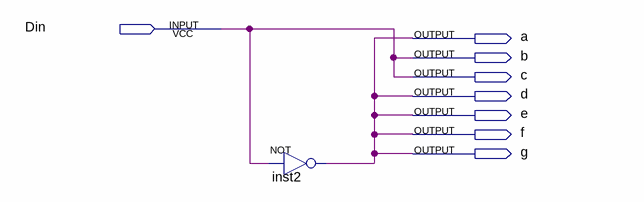
[diagram p0: schematic sheet]
// Quartus schematic render_tapeSymbol_1.bdf as structural Verilog: 1 symbols, 8 pins
module render_tapeSymbol_1 (
  input  Din,
  output a,
  output b,
  output c,
  output d,
  output e,
  output f,
  output g
);

  not inst2 (a, Din);

  assign b = Din;
  assign c = Din;
  assign d = a;
  assign e = a;
  assign f = a;
  assign g = a;
endmodule
